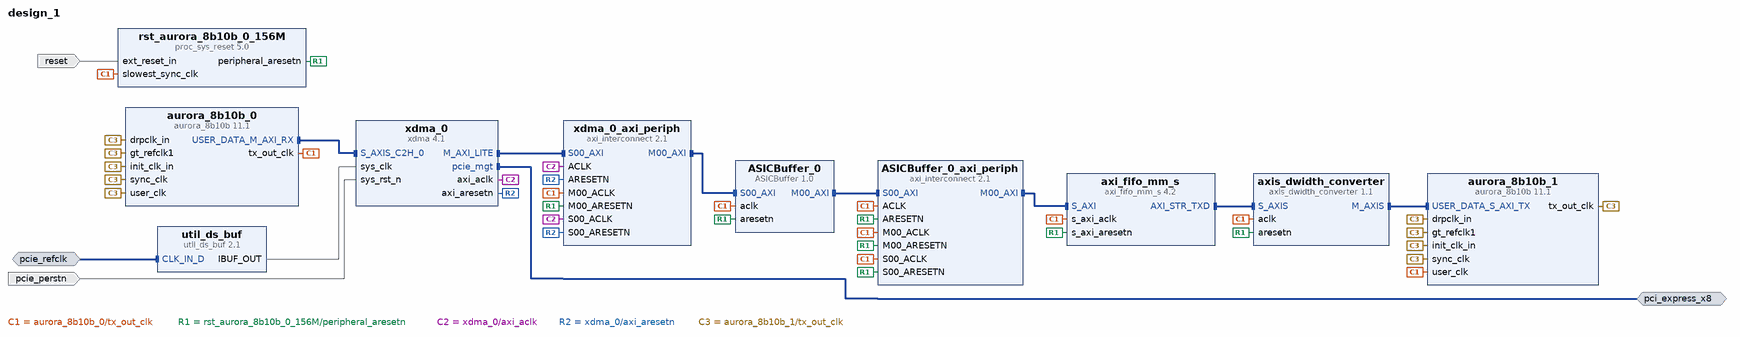
[diagram p0: block diagram of the top level]
# Vivado block design design_1, xc7vx690tffg1761-2, Vivado 2019.1
create_bd_design design_1

create_bd_intf_port -mode Master -vlnv xilinx.com:interface:pcie_7x_mgt_rtl:1.0 pci_express_x8
create_bd_intf_port -mode Slave -vlnv xilinx.com:interface:diff_clock_rtl:1.0 pcie_refclk
set_property -dict {CONFIG.FREQ_HZ 100000000} [get_bd_intf_ports pcie_refclk]
create_bd_port -dir I -type rst reset
set_property -dict {CONFIG.POLARITY ACTIVE_HIGH} [get_bd_ports reset]
create_bd_port -dir I -type rst pcie_perstn
set_property -dict {CONFIG.POLARITY ACTIVE_LOW} [get_bd_ports pcie_perstn]

create_bd_cell -type ip -vlnv xilinx.com:ip:aurora_8b10b:11.1 aurora_8b10b_0
set_property -dict [list \
  CONFIG.Backchannel_mode Timer \
  CONFIG.C_DRP_IF false \
  CONFIG.C_GT_CLOCK_1 GTHQ2 \
  CONFIG.C_GT_LOC_5 X \
  CONFIG.C_GT_LOC_9 1 \
  CONFIG.C_REFCLK_FREQUENCY 250.000 \
  CONFIG.Dataflow_Config RX-only_Simplex \
] [get_bd_cells aurora_8b10b_0]
create_bd_cell -type ip -vlnv xilinx.com:ip:aurora_8b10b:11.1 aurora_8b10b_1
set_property -dict [list \
  CONFIG.Backchannel_mode Timer \
  CONFIG.C_AURORA_LANES 2 \
  CONFIG.C_DRP_IF false \
  CONFIG.C_GT_CLOCK_1 GTHQ3 \
  CONFIG.C_GT_LOC_5 X \
  CONFIG.C_GT_LOC_13 1 \
  CONFIG.C_GT_LOC_14 2 \
  CONFIG.C_REFCLK_FREQUENCY 250.000 \
  CONFIG.C_USE_CRC false \
  CONFIG.Dataflow_Config TX-only_Simplex \
] [get_bd_cells aurora_8b10b_1]
create_bd_cell -type ip -vlnv esa.informatik.tu-darmstadt.de:user:ASICBuffer:1.0 ASICBuffer_0
create_bd_cell -type ip -vlnv xilinx.com:ip:xdma:4.1 xdma_0
set_property -dict [list \
  CONFIG.PCIE_BOARD_INTERFACE pci_express_x8 \
  CONFIG.PF0_DEVICE_ID_mqdma 9038 \
  CONFIG.PF2_DEVICE_ID_mqdma 9038 \
  CONFIG.PF3_DEVICE_ID_mqdma 9038 \
  CONFIG.SYS_RST_N_BOARD_INTERFACE pcie_perstn \
  CONFIG.axi_data_width 256_bit \
  CONFIG.axil_master_64bit_en true \
  CONFIG.axil_master_prefetchable true \
  CONFIG.axilite_master_en true \
  CONFIG.axist_bypass_en false \
  CONFIG.axisten_freq 250 \
  CONFIG.pciebar2axibar_axil_master 0x00000000 \
  CONFIG.pf0_base_class_menu Memory_controller \
  CONFIG.pf0_class_code_base 05 \
  CONFIG.pf0_class_code_interface 00 \
  CONFIG.pf0_class_code_sub 80 \
  CONFIG.pf0_device_id 7038 \
  CONFIG.pf0_sub_class_interface_menu Other_memory_controller \
  CONFIG.pl_link_cap_max_link_speed 8.0_GT/s \
  CONFIG.plltype QPLL1 \
  CONFIG.ref_clk_freq 100_MHz \
  CONFIG.vendor_id 9018 \
  CONFIG.xdma_axi_intf_mm AXI_Stream \
  CONFIG.xdma_axilite_slave false \
  CONFIG.xdma_rnum_chnl 1 \
  CONFIG.xdma_wnum_chnl 1 \
] [get_bd_cells xdma_0]
create_bd_cell -type ip -vlnv xilinx.com:ip:axi_fifo_mm_s:4.2 axi_fifo_mm_s
set_property -dict {CONFIG.C_USE_RX_DATA 0} [get_bd_cells axi_fifo_mm_s]
create_bd_cell -type ip -vlnv xilinx.com:ip:axis_dwidth_converter:1.1 axis_dwidth_converter
set_property -dict {CONFIG.M_TDATA_NUM_BYTES 2} [get_bd_cells axis_dwidth_converter]
create_bd_cell -type ip -vlnv xilinx.com:ip:axi_interconnect:2.1 ASICBuffer_0_axi_periph
set_property -dict {CONFIG.NUM_MI 1} [get_bd_cells ASICBuffer_0_axi_periph]
create_bd_cell -type ip -vlnv xilinx.com:ip:proc_sys_reset:5.0 rst_aurora_8b10b_0_156M
set_property -dict {CONFIG.RESET_BOARD_INTERFACE reset CONFIG.USE_BOARD_FLOW true} [get_bd_cells rst_aurora_8b10b_0_156M]
create_bd_cell -type ip -vlnv xilinx.com:ip:util_ds_buf:2.1 util_ds_buf
set_property -dict {CONFIG.DIFF_CLK_IN_BOARD_INTERFACE pcie_refclk CONFIG.USE_BOARD_FLOW true} [get_bd_cells util_ds_buf]
create_bd_cell -type ip -vlnv xilinx.com:ip:axi_interconnect:2.1 xdma_0_axi_periph
set_property -dict {CONFIG.NUM_MI 1} [get_bd_cells xdma_0_axi_periph]

# ---- connections ----

connect_bd_intf_net [get_bd_intf_pins aurora_8b10b_0/USER_DATA_M_AXI_RX] [get_bd_intf_pins xdma_0/S_AXIS_C2H_0]
connect_bd_intf_net [get_bd_intf_pins axi_fifo_mm_s/AXI_STR_TXD] [get_bd_intf_pins axis_dwidth_converter/S_AXIS]
connect_bd_intf_net [get_bd_intf_pins ASICBuffer_0_axi_periph/M00_AXI] [get_bd_intf_pins axi_fifo_mm_s/S_AXI]
connect_bd_intf_net [get_bd_intf_pins ASICBuffer_0/M00_AXI] [get_bd_intf_pins ASICBuffer_0_axi_periph/S00_AXI]
connect_bd_intf_net [get_bd_intf_pins xdma_0_axi_periph/M00_AXI] [get_bd_intf_pins ASICBuffer_0/S00_AXI]
connect_bd_intf_net [get_bd_intf_ports pcie_refclk] [get_bd_intf_pins util_ds_buf/CLK_IN_D]
connect_bd_intf_net [get_bd_intf_pins xdma_0/M_AXI_LITE] [get_bd_intf_pins xdma_0_axi_periph/S00_AXI]
connect_bd_intf_net [get_bd_intf_ports pci_express_x8] [get_bd_intf_pins xdma_0/pcie_mgt]
connect_bd_intf_net [get_bd_intf_pins axis_dwidth_converter/M_AXIS] [get_bd_intf_pins aurora_8b10b_1/USER_DATA_S_AXI_TX]
connect_bd_net [get_bd_ports reset] [get_bd_pins rst_aurora_8b10b_0_156M/ext_reset_in]
connect_bd_net [get_bd_ports pcie_perstn] [get_bd_pins xdma_0/sys_rst_n]
connect_bd_net [get_bd_pins aurora_8b10b_0/tx_out_clk] \
  [get_bd_pins ASICBuffer_0/aclk] [get_bd_pins ASICBuffer_0_axi_periph/S00_ACLK] \
  [get_bd_pins rst_aurora_8b10b_0_156M/slowest_sync_clk] [get_bd_pins axi_fifo_mm_s/s_axi_aclk] \
  [get_bd_pins ASICBuffer_0_axi_periph/M00_ACLK] [get_bd_pins ASICBuffer_0_axi_periph/ACLK] \
  [get_bd_pins aurora_8b10b_1/user_clk] [get_bd_pins axis_dwidth_converter/aclk] [get_bd_pins xdma_0_axi_periph/M00_ACLK]
connect_bd_net [get_bd_pins rst_aurora_8b10b_0_156M/peripheral_aresetn] \
  [get_bd_pins ASICBuffer_0/aresetn] [get_bd_pins ASICBuffer_0_axi_periph/S00_ARESETN] \
  [get_bd_pins axi_fifo_mm_s/s_axi_aresetn] [get_bd_pins ASICBuffer_0_axi_periph/M00_ARESETN] \
  [get_bd_pins ASICBuffer_0_axi_periph/ARESETN] [get_bd_pins axis_dwidth_converter/aresetn] \
  [get_bd_pins xdma_0_axi_periph/M00_ARESETN]
connect_bd_net [get_bd_pins util_ds_buf/IBUF_OUT] [get_bd_pins xdma_0/sys_clk]
connect_bd_net [get_bd_pins xdma_0/axi_aclk] [get_bd_pins xdma_0_axi_periph/S00_ACLK] [get_bd_pins xdma_0_axi_periph/ACLK]
connect_bd_net [get_bd_pins xdma_0/axi_aresetn] [get_bd_pins xdma_0_axi_periph/S00_ARESETN] [get_bd_pins xdma_0_axi_periph/ARESETN]
connect_bd_net [get_bd_pins aurora_8b10b_1/tx_out_clk] \
  [get_bd_pins aurora_8b10b_0/drpclk_in] [get_bd_pins aurora_8b10b_0/init_clk_in] [get_bd_pins aurora_8b10b_0/user_clk] \
  [get_bd_pins aurora_8b10b_0/sync_clk] [get_bd_pins aurora_8b10b_0/gt_refclk1] [get_bd_pins aurora_8b10b_1/drpclk_in] \
  [get_bd_pins aurora_8b10b_1/init_clk_in] [get_bd_pins aurora_8b10b_1/sync_clk] [get_bd_pins aurora_8b10b_1/gt_refclk1]

# ---- address map ----
assign_bd_address -offset 0x0000000044A00000 -range 64K -target_address_space [get_bd_addr_spaces ASICBuffer_0/M00_AXI] [get_bd_addr_segs axi_fifo_mm_s/S_AXI/Mem0]

validate_bd_design
save_bd_design
